# EAGLE design ga_module (EAGLE 9.3.0)
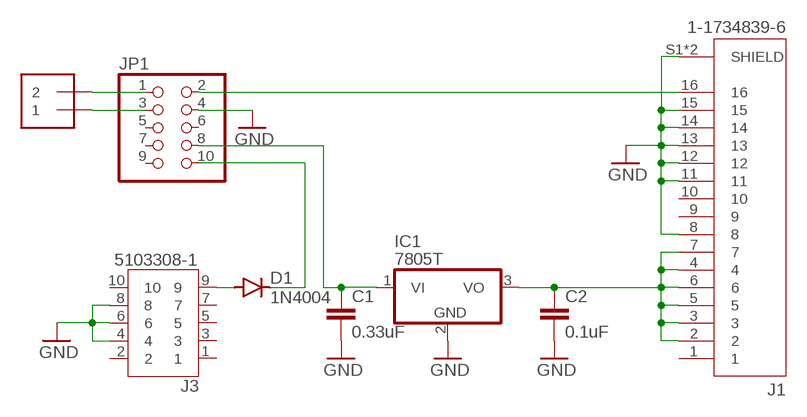
[diagram p0: schematic, sheet 1]

## Parts
C1  0.33uF  0.1UF-KIT-EZ-50V-20%  [CAP-PTH-SMALL-KIT]
C2  0.1uF  0.1UF-KIT-EZ-50V-20%  [CAP-PTH-SMALL-KIT]
D1  1N4004  [DO41-10]
IC1  7805T  [TO220H]
J1  1-1734839-6  [TE_1-1734839-6]
J2  1X2-3.5MM  [1X2-3.5MM]
J3  5103308-1  [TE_5103308-1]
JP1  PINHD-2X5/90  [2X05/90]

## Nets
GND: C1.2 C2.2 IC1.2(GND) J1.8 J1.11 J1.12 J1.13 J1.14 J1.15 J1.S1(SHIELD) J1.S2(SHIELD) J3.4 J3.6 J3.8 JP1.4
N$1: D1.A J3.9
N$2: J2.2 JP1.1
N$3: J1.16 JP1.2
N$4: C2.1 IC1.3(VO) J1.2 J1.3 J1.4 J1.5 J1.6 J1.7
N$6: J2.1 JP1.3
N$8: D1.C JP1.10
N$9: C1.1 IC1.1(VI) JP1.8
Unconnected: J1.1 J1.9 J1.10 J3.1 J3.2 J3.3 J3.5 J3.7 J3.10 JP1.5 JP1.6 JP1.7 JP1.9

## Library data of the parts
C1 = SparkFun-Capacitors:0.1UF: 0.1µF ceramic capacitors A capacitor is a passive two-terminal electrical component used to store electrical energy temporarily in an electric field.; PROD_ID: CAP-08370; VALUE: 0.1uF
C2 = SparkFun-Capacitors:0.1UF: 0.1µF ceramic capacitors A capacitor is a passive two-terminal electrical component used to store electrical energy temporarily in an electric field.; PROD_ID: CAP-08370
D1 = diode:1N4004: DIODE general purpose rectifier, 1 A
IC1 = linear:78*: Positive VOLTAGE REGULATOR Source: http://cache.national.com/ds/LM/LM78L05.pdf http://www.fairchildsemi.com/ds/LM/LM7805.pdf
J1 = 1-1734839-6:1-1734839-6: Conn FPC Connector SKT 16 POS 0.5mm Solder RA SMD T/R; AVAILABILITY: Unavailable; COMMENT: 1-1734839-6; DESCRIPTION: Conn FPC Connector SKT 16 POS 0.5mm Solder RA SMD T/R; EU_ROHS_COMPLIANCE: Compliant; MF: TE Connectivity; MP: 1-1734839-6; PACKAGE: None; PRICE: None; TE_PURCHASE_URL: https://www.te.com/usa-en/product-1-1734839-6.html?te_bu=Cor&te_type=disp&te_campaign=seda_glo_cor-seda-global-disp-prtnr-fy19-seda-model-bom-cta_sma-317_1&elqCampaignId=32493
J2 = adafruit:1X2: 3.5mm Terminal block http://www.ladyada.net/library/pcb/eaglelibrary.html
J3 = 5103308-1:5103308-1: CONN HEADER LOPRO STR 10POS GOLD; AVAILABILITY: Unavailable; CENTERLINE_PITCH: 2.54 mm[.1 in]; COMMENT: 5103308-1; DESCRIPTION: A/L LOW PRO HDR 10P VERT BLACK; EU_ROHS_COMPLIANCE: Compliant; MF: TE Connectivity; MP: 5103308-1; NUMBER_OF_POSITIONS: 10; PACKAGE: None; PRICE: None; PRODUCT_TYPE: Connector; TE_PURCHASE_URL: https://www.te.com/usa-en/product-5103308-1.html?te_bu=Cor&te_type=disp&te_campaign=seda_glo_cor-seda-global-disp-prtnr-fy19-seda-model-bom-cta_sma-317_1&elqCampaignId=32493
JP1 = pinhead:PINHD-2X5: PIN HEADER

## Board
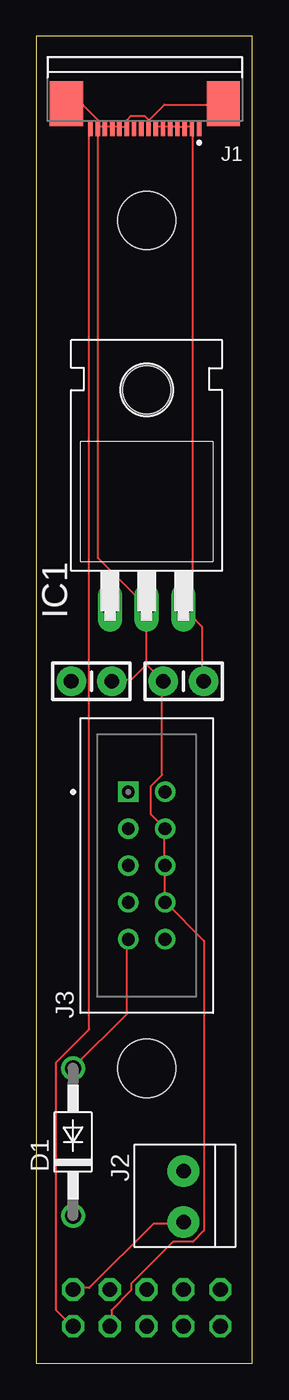
[diagram p1: board, top side]
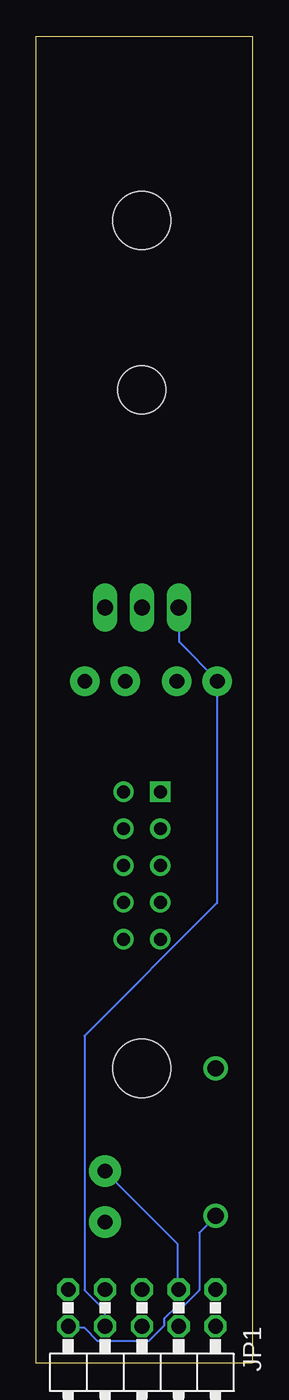
[diagram p2: board, bottom side, seen from below]

Size 14.91 x 91.43 mm. Coordinates in mm from the lower left corner, seen from the top.
Outline: 0,0 14.91,0 14.91,91.43 0,91.43 0,0
Copper layers (1*16): Top 0.035mm / dielectric 1.5mm / Bottom 0.035mm
Design rules "default": minimum track width 6mil, minimum drill 0.35mm, track to track 6mil, track to pad 6mil, pad to pad 6mil, via to via 6mil, smd to smd 6mil, copper to edge 40mil, drill to drill 6mil, minimum pad ring 10mil, minimum via ring 8mil, stop-mask expansion 4mil, vias tented up to drill 0mil, thermal gap 10mil
Holes 4.01 mm at 7.62,78.74 7.62,20.32

### Footprints (pad centres in the part's own frame; a part is rotated, then mirrored left to right if it is on the bottom)
CAP-PTH-SMALL-KIT = drill 1.016 pad 2.032: 1 -1.397,0; 2 1.397,0
DO41-10 = drill 1.118: A 5.08,0; C -5.08,0
TO220H = drill 1.118 long: 1 -2.54,-10.16; 2 0,-10.16; 3 2.54,-10.16 | hole 3.302: 0,4.826
TE_1-1734839-6 = smd 0.3 x 1.1: 1 -3.75,0; 2 -3.25,0; 3 -2.75,0; 4 -2.25,0; 5 -1.75,0; 6 -1.25,0; 7 -0.75,0; 8 -0.25,0; 9 0.25,0; 10 0.75,0; 11 1.25,0; 12 1.75,0; 13 2.25,0; 14 2.75,0; 15 3.25,0; 16 3.75,0 | smd 2.3 x 3.1: S1 -5.42,-1.7; S2 5.42,-1.7
1X2-3.5MM = drill 1 pad 2.184: 1 1.8,0; 2 -1.7,0
TE_5103308-1 = drill 0.889 square: 1 5.08,1.27 | drill 0.889: 2 5.08,-1.27; 3 2.54,1.27; 4 2.54,-1.27; 5 0,1.27; 6 0,-1.27; 7 -2.54,1.27; 8 -2.54,-1.27; 9 -5.08,1.27; 10 -5.08,-1.27
2X05/90 = drill 1.016 octagon: 1 -5.08,-6.35; 2 -5.08,-3.81; 3 -2.54,-6.35; 4 -2.54,-3.81; 5 0,-6.35; 6 0,-3.81; 7 2.54,-6.35; 8 2.54,-3.81; 9 5.08,-6.35; 10 5.08,-3.81

### Placement (x,y rotation side)
C1  3.81,46.99 0 top
C2  10.16,46.99 180 top
D1  2.54,15.24 90 top
IC1  7.62,62.23 0 top
J1  7.49,85.09 180 top
J2  10.16,11.43 90 top
J3  7.62,34.29 90 top
JP1  7.62,-1.27 180 bottom

### Tracks (layer width: path | path; a pad name or v marks a point on that pad's centre or on a via)
GND
  Top 0.152: 4.27,85.19 4.72,85.19 J1.14 4.88,85.19 5.18,85.19 J1.13 5.33,85.19 5.64,85.19 J1.12 5.79,85.19 6.1,85.19 J1.11 6.25,85.19 6.25,85.65 6.55,85.95 7.47,85.95 7.77,85.65 | 7.77,85.65 7.77,85.19 J1.8 | 4.27,85.19 4.27,85.65 3.2,86.72 2.13,86.72 J1.S2 | 4.27,85.19 J1.15 4.27,85.04 4.27,55.47 7.62,52.12 IC1.2 7.62,48.16 | 7.77,85.65 8.84,86.72 12.8,86.72 J1.S1 | 7.62,48.16 8.69,47.09 C2.2 8.69,46.94 8.69,40.54 7.92,39.78 7.92,37.8 J3.4 8.84,36.73 8.84,34.29 | 7.62,48.16 6.55,47.09 5.33,47.09 C1.2 | 8.84,34.29 8.84,31.85 J3.8 8.99,31.7 11.58,29.11 11.58,9.14 10.82,8.38 9.45,8.38 6.55,5.49 6.55,5.03 5.18,3.66 5.18,2.59 JP1.4 | 8.84,34.29 J3.6
N$1
  Top 0.152: J3.9 6.25,29.11 6.25,24.08 2.59,20.42 D1.A
N$2
  Top 0.152: JP1.1 2.59,5.18 3.66,5.18 8.08,9.6 10.06,9.6 J2.2
N$3
  Top 0.152: J1.16 3.66,85.04 3.66,23.01 1.37,20.73 1.37,3.66 2.44,2.59 JP1.2
N$4
  Top 0.152: J1.7 8.38,85.19 8.69,85.19 J1.6 8.84,85.19 9.14,85.19 J1.5 9.3,85.19 9.6,85.19 J1.4 9.75,85.19 10.21,85.19 J1.3 10.36,85.19 10.67,85.19 J1.2 10.82,85.04 10.82,52.73 IC1.3 10.21,51.97 11.43,50.75 11.43,47.09 C2.1
N$6
  Bottom 0.152: JP1.3 5.18,5.18 5.18,8.23 10.06,13.11 J2.1
N$8
  Bottom 0.152: JP1.10 12.65,2.44 11.58,2.44 10.67,1.52 7.16,1.52 6.1,2.59 6.1,3.05 5.18,3.96 4.72,3.96 3.66,5.03 3.66,8.99 2.59,10.06 D1.C
N$9
  Bottom 0.152: JP1.8 10.21,2.59 10.21,3.66 11.58,5.03 11.58,22.55 2.44,31.7 2.44,46.94 C1.1 2.44,47.09 5.03,49.68 5.03,51.97 IC1.1